# Altium project ServoSurucu.PrjPcb
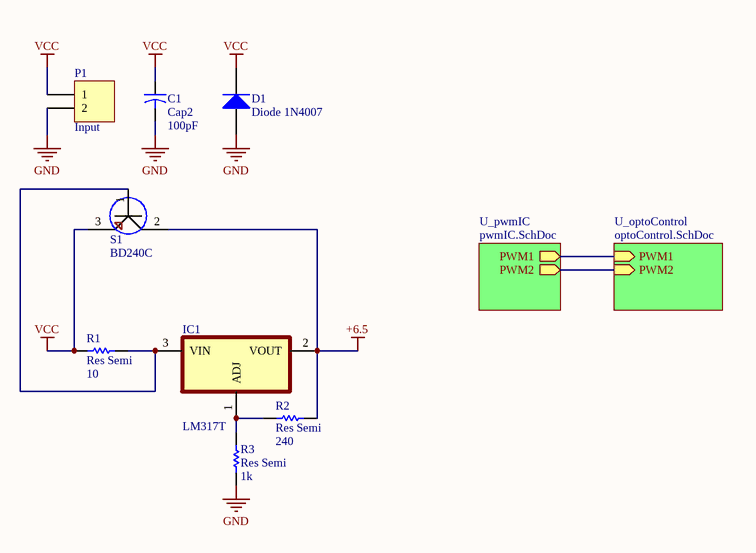
[diagram p0: ServoSurucuSematik.SchDoc]
4 sheets, 32 parts. Net scope: hierarchical (ports join the sheet entries above them; power ports are global).
Board file: ServoSurucuPCB.PcbDoc
Sheets:
  ServoSurucuSematik.SchDoc
    U_pwmIC = pwmIC.SchDoc
    U_optoControl = optoControl.SchDoc
  powerLine.SchDoc

## Sheet ServoSurucuSematik.SchDoc
size A4

### Parts
C1  Cap2  value 100pF  [CAPR5-4X5]
D1  Diode 1N4007  [DO-41]
IC1  LM317T  [LM317]
P1  Input  [HDR1X2]
R1  Res Semi  value 10  [AXIAL-0.5]
R2  Res Semi  value 240  [AXIAL-0.5]
R3  Res Semi  value 1k  [AXIAL-0.5]
S1  BD240C  [BD240C]

### Sub-sheets
U_optoControl = optoControl.SchDoc: PWM1 (in), PWM2 (in)
U_pwmIC = pwmIC.SchDoc: PWM1 (out), PWM2 (out)

### Nets
+6.5: IC1.2(VOUT) R2.1 S1.2
GND: C1.2 D1.1(A) P1.2 R3.2  [project net optoEmiter1]
VCC: C1.1 D1.2(K) P1.1 R1.2 S1.3
NetIC1_1: IC1.1(ADJ) R2.2 R3.1
NetIC1_3: IC1.3(VIN) R1.1 S1.1
NetP4_2: sheet U_pwmIC/PWM1, sheet U_optoControl/PWM1
NetP7_2: sheet U_pwmIC/PWM2, sheet U_optoControl/PWM2

### Library data of the parts
C1 = Cap2: Capacitor; Published: 23-Sep-2002; PackageReference: CAPR5-4X5; Publisher: Altium Limited; PackageDescription: Capacitor; 2 Leads
D1 = Diode 1N4007: 1 Amp General Purpose Rectifier; Published: 8-Jun-2000; LatestRevisionDate: 17-Jul-2002; LatestRevisionNote: Re-released for DXP Platform.; DatasheetVersion: 1998; PackageVersion: Aug-1999; PackageReference: DO-41; Publisher: Altium Limited; PackageDescription: Diode, Axial; Body 5.2 x 2.7 mm (LxDia. max), Lead Dia. 0.86 mm (max); Code_JEDEC: DO-204-AL; ComponentLink1Description: Manufacturer Link; ComponentLink1URL: http://www.fairchildsemi.com/; ComponentLink2Description: Datasheet; ComponentLink2URL: http://www.fairchildsemi.com/ds/1N%2F1N4001.pdf
IC1 = LM317T: 1.5-A, 40-V, adjustable linear voltage regulator 3-TO-220; MF: Texas Instruments; Arrow_Electronics-Purchase-URL: https://snapeda.com/shop?store=Arrow+Electronics&id=2756289; Price: None; Value: *; Availability: Unavailable; DigiKey-Purchase-URL: https://snapeda.com/shop?store=DigiKey&id=2756289; Mouser-Purchase-URL: https://snapeda.com/shop?store=Mouser&id=2756289; SnapEDA_Link: https://www.snapeda.com/parts/LM317T/Texas%20Instruments/view-part/2756289/?ref=snap; MP: LM317T; Package: TO-220-3 Texas Instruments
P1 = Header 2: Header, 2-Pin; LatestRevisionDate: 17-Jul-2002; LatestRevisionNote: Re-released for DXP Platform.; Publisher: Altium Limited
R1-R3 = Res Semi: Semiconductor Resistor; Published: 8-Jun-2000; LatestRevisionDate: 17-Jul-2002; LatestRevisionNote: Re-released for DXP Platform.; PackageReference: AXIAL-0.5; Publisher: Altium Limited; PackageDescription: Axial Device, Thru-Hole; 2 Leads; 0.5 in Pin Spacing
S1 = BD240C: TO 220

## Sheet pwmIC.SchDoc
size A4
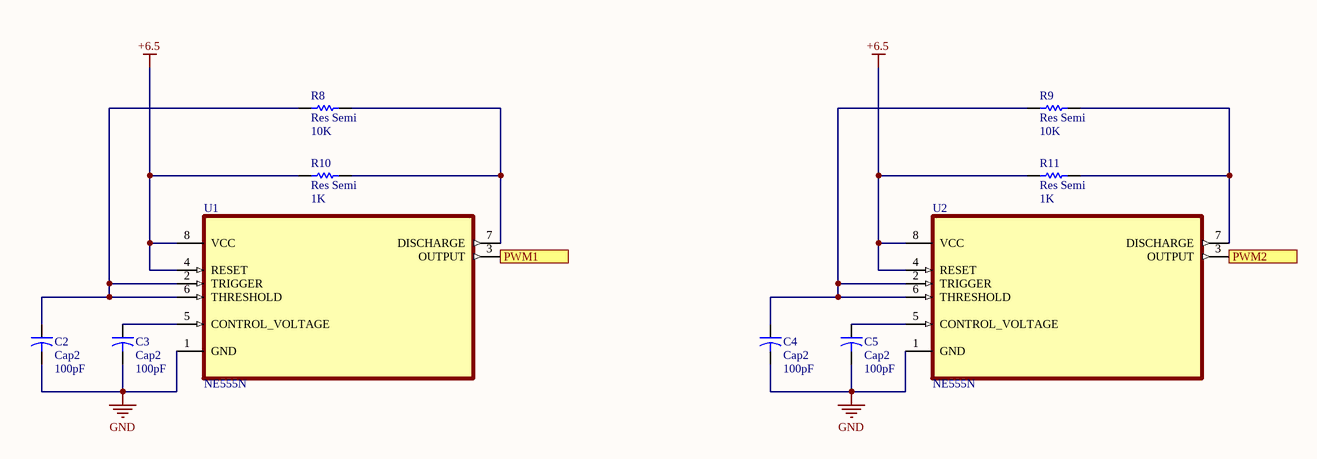
[diagram p1: pwmIC.SchDoc]

### Parts
C2  Cap2  value 100pF  [CAPR5-4X5]
C3  Cap2  value 100pF  [CAPR5-4X5]
C4  Cap2  value 100pF  [CAPR5-4X5]
C5  Cap2  value 100pF  [CAPR5-4X5]
R8  Res Semi  value 10K  [AXIAL-0.5]
R9  Res Semi  value 10K  [AXIAL-0.5]
R10  Res Semi  value 1K  [AXIAL-0.5]
R11  Res Semi  value 1K  [AXIAL-0.5]
U1  NE555N  [NE555 -T]
U2  NE555N  [NE555 -T]

### Ports
PWM1 (out), PWM2 (out)

### Nets
+6.5: R10.1 R11.1 U1.4(RESET) U1.8(VCC) U2.4(RESET) U2.8(VCC)
GND: C2.2 C3.2 C4.2 C5.2 U1.1(GND) U2.1(GND)  [project net optoEmiter1]
NetC2_1: C2.1 R8.1 U1.2(TRIGGER) U1.6(THRESHOLD)
NetC3_1: C3.1 U1.5(CONTROL_VOLTAGE)
NetC4_1: C4.1 R9.1 U2.2(TRIGGER) U2.6(THRESHOLD)
NetC5_1: C5.1 U2.5(CONTROL_VOLTAGE)
NetP4_2: U1.3(OUTPUT) ; port PWM1
NetP7_2: U2.3(OUTPUT) ; port PWM2
NetR8_2: R8.2 R10.2 U1.7(DISCHARGE)
NetR9_2: R9.2 R11.2 U2.7(DISCHARGE)

### Library data of the parts
C2-C5 = Cap2: Capacitor; Published: 23-Sep-2002; PackageReference: CAPR5-4X5; Publisher: Altium Limited; PackageDescription: Capacitor; 2 Leads
R8-R11 = Res Semi: Semiconductor Resistor; Published: 8-Jun-2000; LatestRevisionDate: 17-Jul-2002; LatestRevisionNote: Re-released for DXP Platform.; PackageReference: AXIAL-0.5; Publisher: Altium Limited; PackageDescription: Axial Device, Thru-Hole; 2 Leads; 0.5 in Pin Spacing
U1 U2 = NE555N: 555 Type, Timer/Oscillator _Single_ IC 8-DIP; MF: ON Semiconductor; Value: *; Price: None; Package: DIP-8 Texas Instruments; SnapEDA_Link: https://www.snapeda.com/parts/NE555N/ON%20Semiconductor/view-part/2757993/?ref=snap; Availability: Unavailable; MP: NE555N

## Sheet optoControl.SchDoc
size A4
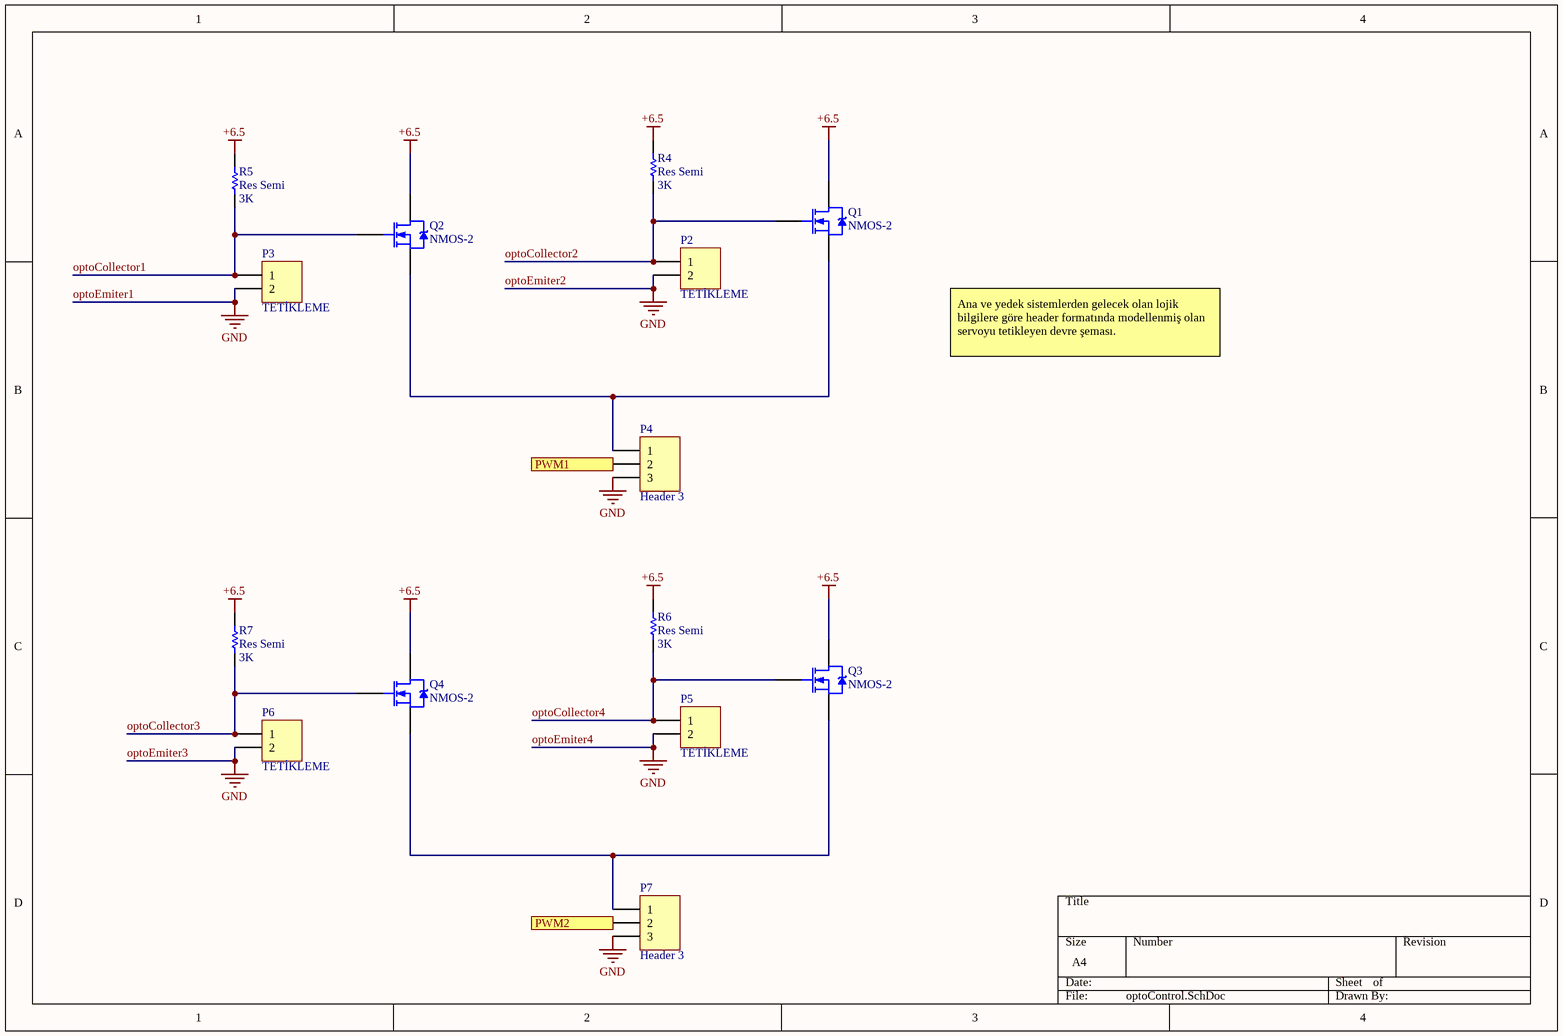
[diagram p2: optoControl.SchDoc]

### Parts
P2  TETİKLEME  [HDR1X2]
P3  TETİKLEME  [HDR1X2]
P4  Header 3  [HDR1X3]
P5  TETİKLEME  [HDR1X2]
P6  TETİKLEME  [HDR1X2]
P7  Header 3  [HDR1X3]
Q1  NMOS-2  [TO-220AB]
Q2  NMOS-2  [TO-220AB]
Q3  NMOS-2  [TO-220AB]
Q4  NMOS-2  [TO-220AB]
R4  Res Semi  value 3K  [AXIAL-0.5]
R5  Res Semi  value 3K  [AXIAL-0.5]
R6  Res Semi  value 3K  [AXIAL-0.5]
R7  Res Semi  value 3K  [AXIAL-0.5]

### Ports
PWM1 (in), PWM2 (in)

### Nets
+6.5: Q1.2(D) Q2.2(D) Q3.2(D) Q4.2(D) R4.2 R5.2 R6.2 R7.2
optoEmiter1: P2.2 P3.2 P4.3 P5.2 P6.2 P7.3  [also labelled GND, optoEmiter2, optoEmiter3, optoEmiter4]
optoCollector1: P3.1 Q2.1(G) R5.1
optoCollector2: P2.1 Q1.1(G) R4.1
optoCollector3: P6.1 Q4.1(G) R7.1
optoCollector4: P5.1 Q3.1(G) R6.1
NetP4_1: P4.1 Q1.3(S) Q2.3(S)
NetP4_2: P4.2 ; port PWM1
NetP7_1: P7.1 Q3.3(S) Q4.3(S)
NetP7_2: P7.2 ; port PWM2

### Notes on the sheet
- Ana ve yedek sistemlerden gelecek olan lojik bilgilere göre header formatında modellenmiş olan servoyu tetikleyen devre şeması.

### Library data of the parts
P2 P3 P5 P6 = Header 2: Header, 2-Pin; LatestRevisionDate: 17-Jul-2002; LatestRevisionNote: Re-released for DXP Platform.; Publisher: Altium Limited
P4 P7 = Header 3: Header, 3-Pin; LatestRevisionDate: 17-Jul-2002; LatestRevisionNote: Re-released for DXP Platform.; Publisher: Altium Limited
Q1-Q4 = NMOS-2: N-Channel Power MOSFET; Note: Pin 2 is electrically connected to pin 4.; Published: 8-Jun-2000; LatestRevisionDate: 17-Jul-2002; LatestRevisionNote: Re-released for DXP Platform.; DatasheetVersion: PD-9.814; PackageVersion: Feb-1997; PackageReference: TO-220AB; Publisher: Altium Limited; PackageDescription: TO, Thru-Hole, Vertical, Heatsink Mounted; 3 In-Line Leads; Pitch 2.54 mm; ComponentLink1Description: Manufacturer Link; ComponentLink1URL: http://www.irf.com/
R4-R7 = Res Semi: Semiconductor Resistor; Published: 8-Jun-2000; LatestRevisionDate: 17-Jul-2002; LatestRevisionNote: Re-released for DXP Platform.; PackageReference: AXIAL-0.5; Publisher: Altium Limited; PackageDescription: Axial Device, Thru-Hole; 2 Leads; 0.5 in Pin Spacing

## Sheet powerLine.SchDoc
size A4

## Nets that join several sheets
+6.5: ServoSurucuSematik (IC1.2 R2.1 S1.2), pwmIC (6 pins), optoControl (8 pins)
optoEmiter1: ServoSurucuSematik (C1.2 D1.1 P1.2 R3.2), pwmIC (6 pins), optoControl (6 pins)
NetP4_2: pwmIC (U1.3), optoControl (P4.2)
NetP7_2: pwmIC (U2.3), optoControl (P7.2)